# Altium project PCB_Project.PrjPcb
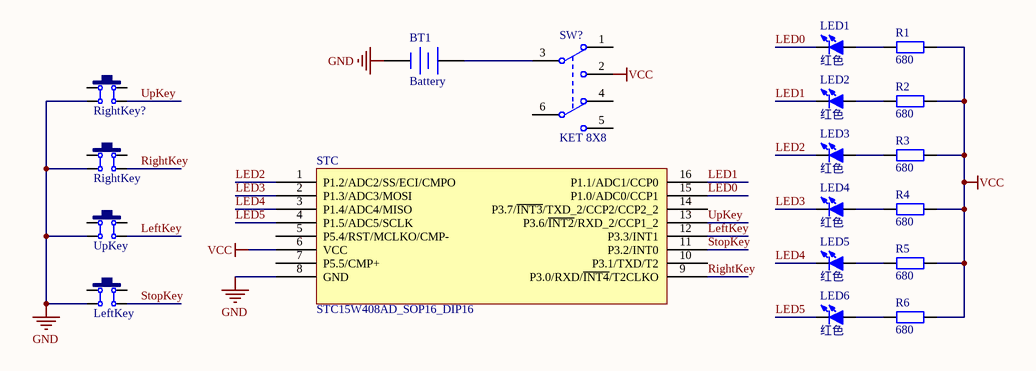
[diagram p0: ElectronicSheet.SchDoc]
1 sheet, 19 parts. Net scope: global (net labels, ports and power ports of the same name join across sheets).

## Sheet ElectronicSheet.SchDoc
size A4

### Parts
BT1  Battery  [CR1220]
LED1  红色  [LED 5MM-B]
LED2  红色  [LED 5MM-B]
LED3  红色  [LED 5MM-B]
LED4  红色  [LED 5MM-B]
LED5  红色  [LED 5MM-B]
LED6  红色  [LED 5MM-B]
LeftKey  6x6x5  [TSW DIP-6*6*6]  (value not drawn)
R1  680  [RS 1/4W]
R2  680  [RS 1/4W]
R3  680  [RS 1/4W]
R4  680  [RS 1/4W]
R5  680  [RS 1/4W]
R6  680  [RS 1/4W]
RightKey  6x6x5  [TSW DIP-6*6*6]  (value not drawn)
RightKey?  6x6x5  [TSW DIP-6*6*6]  (value not drawn)
STC  STC15W408AD_SOP16_DIP16  [DIP16]
SW?  KET 8X8  [KFT DIP-8X8]
UpKey  6x6x5  [TSW DIP-6*6*6]  (value not drawn)

### Nets
GND: BT1.2(-) LeftKey.4 RightKey.4 RightKey?.4 STC.8(GND) UpKey.4
VCC: R1.1 R2.1 R3.1 R4.1 R5.1 R6.1 STC.6(VCC) SW?.2(COM2)
LED0: LED1.2(K) STC.15(P1.0/ADC0/CCP1)
LED1: LED2.2(K) STC.16(P1.1/ADC1/CCP0)
LED2: LED3.2(K) STC.1(P1.2/ADC2/SS/ECI/CMPO)
LED3: LED4.2(K) STC.2(P1.3/ADC3/MOSI)
LED4: LED5.2(K) STC.3(P1.4/ADC4/MISO)
LED5: LED6.2(K) STC.4(P1.5/ADC5/SCLK)
LeftKey: STC.12(P3.3/INT1) UpKey.3
RightKey: RightKey.3 STC.9(P3.0/RXD/~{INT4}/T2CLKO)
StopKey: LeftKey.3 STC.11(P3.2/INT0)
UpKey: RightKey?.3 STC.13(P3.6/~{INT2}/RXD_2/CCP1_2)
NetBT1_1: BT1.1(+) SW?.3(NO1)
NetLED1_1: LED1.1(A) R1.2
NetLED2_1: LED2.1(A) R2.2
NetLED3_1: LED3.1(A) R3.2
NetLED4_1: LED4.1(A) R4.2
NetLED5_1: LED5.1(A) R5.2
NetLED6_1: LED6.1(A) R6.2

Not connected (* = marked no-connect by the designer): LeftKey 1 2; RightKey 1 2; RightKey? 1 2; STC 5(P5.4/RST/MCLKO/CMP-) 7(P5.5/CMP+) 10(P3.1/TXD/T2) 14(P3.7/~{INT3}/TXD_2/CCP2/CCP2_2); SW? 1(NC1) 4(NO2) 5(COM2) 6(NC2); UpKey 1 2

### Library data of the parts
BT1 = Battery: 备份电池; Published: 24-Mar-1999; LatestRevisionDate: 17-Jul-2002; LatestRevisionNote: Re-released for DXP Platform.; PackageReference: BAT-2; Publisher: Altium Limited
LED1-LED6 = LED-5MM: 5mm插件LED; 版权归属: 源创客; BOM名称: 5mm插件LED; 学习资源: www.ooocke.com
LeftKey RightKey RightKey? UpKey = TSW DIP-6x6: 直插6x6轻触开关; 版权归属: 源创客; BOM名称: 直插6x6轻触开关; 学习资源: www.ooocke.com
R1-R6 = R-CRR: 直插色环电阻; BOM名称: 色环电阻; 版权归属: 源创客; 学习资源: www.ooocke.com
SW? = KET 8X8: 8*8自锁开关; 版权归属: 源创客; BOM名称: 8*8自锁开关; 学习资源: www.ooocke.com